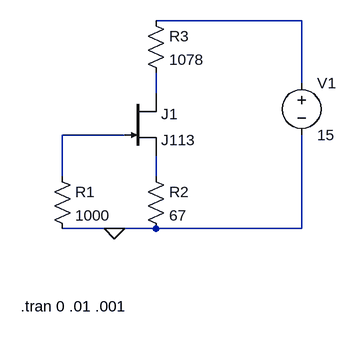
[diagram p0: schematic circuit2.asc]
circuit2.asc, the LTspice schematic file:
Version 4
SHEET 1 880 680
WIRE 560 64 336 64
WIRE 560 160 560 64
WIRE 336 176 336 144
WIRE 288 240 192 240
WIRE 192 304 192 240
WIRE 336 304 336 272
WIRE 272 384 192 384
WIRE 336 384 272 384
WIRE 560 384 560 240
WIRE 560 384 336 384
FLAG 272 384 0
SYMBOL Res 176 288 R0
SYMATTR InstName R1
SYMATTR Value 1000
SYMBOL Res 320 288 R0
SYMATTR InstName R2
SYMATTR Value 67
SYMBOL Res 320 48 R0
SYMATTR InstName R3
SYMATTR Value 1078
SYMBOL njf 288 176 R0
SYMATTR InstName J1
SYMATTR Value J113
SYMBOL Voltage 560 144 R0
SYMATTR InstName V1
SYMATTR Value 15
TEXT 128 504 Left 2 !.tran 0 .01 .001

The netlist it stands for:
* circuit2.asc
R1 N003 0 1000
R2 N004 0 67
R3 N001 N002 1078
J1 N002 N003 N004 J113
V1 N001 0 15
.model NJF NJF
.model PJF PJF
.lib standard.jft
.tran 0 .01 .001
.backanno
.end